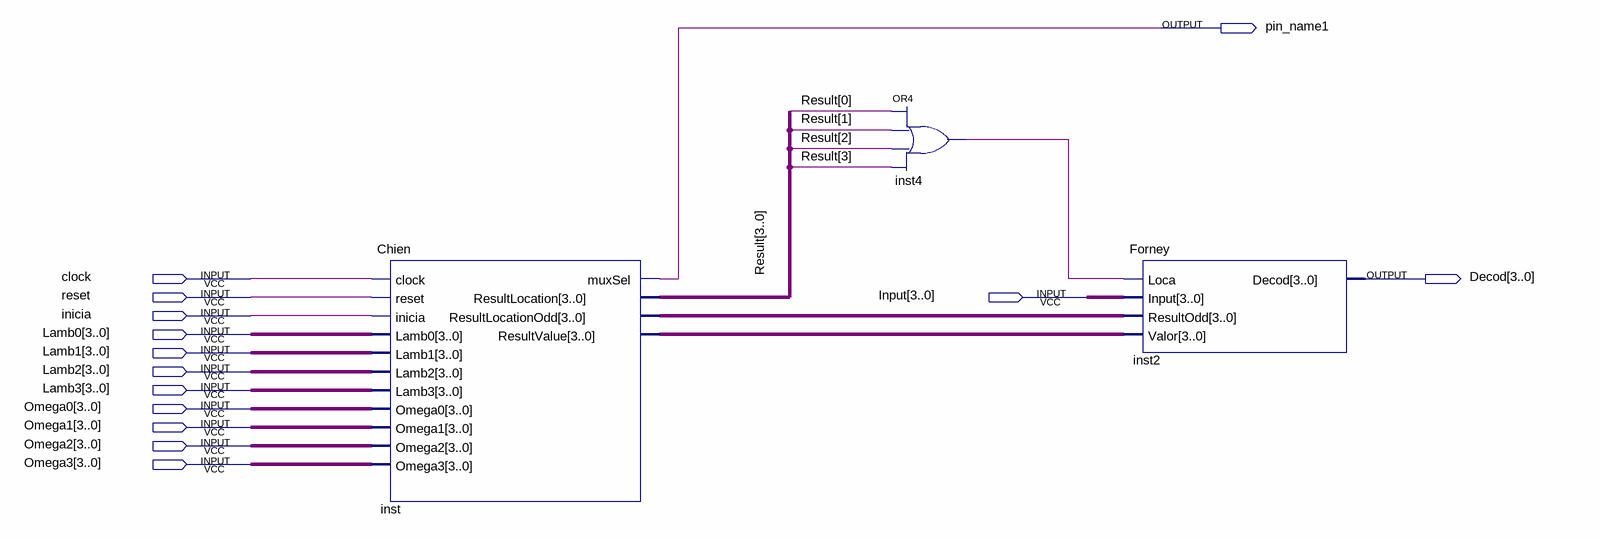
[diagram p0: schematic sheet]
// Quartus schematic ChienForney.bdf as structural Verilog: 3 symbols, 14 pins
module ChienForney (
  input  clock,
  input  reset,
  input  [3:0] Input,
  input  inicia,
  input  [3:0] Lamb0,
  input  [3:0] Lamb1,
  input  [3:0] Lamb2,
  input  [3:0] Lamb3,
  input  [3:0] Omega0,
  input  [3:0] Omega1,
  input  [3:0] Omega2,
  input  [3:0] Omega3,
  output pin_name1,
  output [3:0] Decod
);

  wire inst4_out;
  wire [3:0] inst_resultlocationodd, inst_resultvalue, Result;

  Chien inst (
    .clock(clock), .reset(reset), .inicia(inicia), .Lamb0(Lamb0), .Lamb1(Lamb1), .Lamb2(Lamb2),
    .Lamb3(Lamb3), .Omega0(Omega0), .Omega1(Omega1), .Omega2(Omega2), .Omega3(Omega3), .muxSel(pin_name1),
    .ResultLocation(Result), .ResultLocationOdd(inst_resultlocationodd), .ResultValue(inst_resultvalue));
  or inst4 (inst4_out, Result[0], Result[1], Result[2], Result[3]);
  Forney inst2 (
    .Loca(inst4_out), .Input(Input), .ResultOdd(inst_resultlocationodd), .Valor(inst_resultvalue),
    .Decod(Decod));
endmodule
